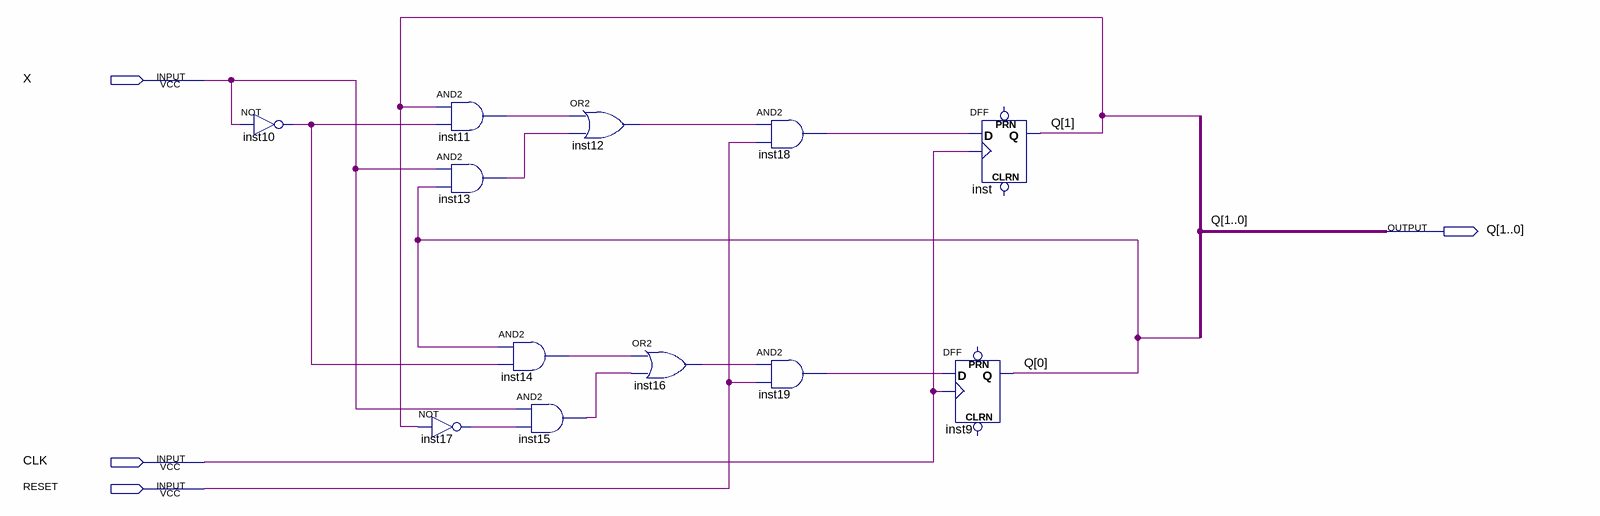
[diagram p0: schematic sheet]
// Quartus schematic MEF.bdf as structural Verilog: 12 symbols, 4 pins
module MEF (
  input  X,
  input  CLK,
  input  RESET,
  output [1:0] Q
);

  wire inst10_out, inst11_out, inst12_out, inst13_out, inst14_out, inst15_out, inst16_out, inst17_out,
       inst18_out, inst19_out;

  not inst10 (inst10_out, X);
  and inst11 (inst11_out, Q[1], inst10_out);
  and inst13 (inst13_out, X, Q[0]);
  not inst17 (inst17_out, Q[1]);
  and inst14 (inst14_out, Q[0], inst10_out);
  or inst12 (inst12_out, inst11_out, inst13_out);
  and inst15 (inst15_out, X, inst17_out);
  or inst16 (inst16_out, inst14_out, inst15_out);
  and inst18 (inst18_out, inst12_out, RESET);
  and inst19 (inst19_out, inst16_out, RESET);
  DFF inst (.CLK(CLK), .D(inst18_out), .Q(Q[1]));  // open: CLRN, PRN
  DFF inst9 (.CLK(CLK), .D(inst19_out), .Q(Q[0]));  // open: CLRN, PRN
endmodule
